# EAGLE schematic FreqDiv12080 (EAGLE 6.1)
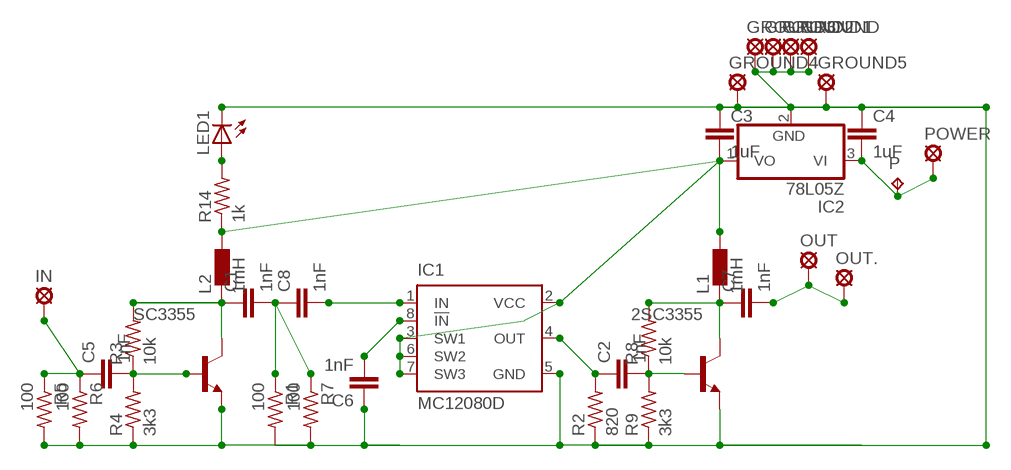
[diagram p0: schematic, sheet 1]

## Parts
2SC3355  BF199-NPN-TO92-BEC  [TO92-BEC]
C1  1nF  C5/3.5  [C5B3.5]
C2  1nF  C5/3.5  [C5B3.5]
C3  1uF  C5/3.5  [C5B3.5]
C4  1uF  C5/3.5  [C5B3.5]
C5  1nF  C5/3.5  [C5B3.5]
C6  1nF  C5/3.5  [C5B3.5]
C7  1nF  C5/3.5  [C5B3.5]
C8  1nF  C5/3.5  [C5B3.5]
GROUND  SE13  [SE13]
GROUND1  SE13  [SE13]
GROUND2  SE13  [SE13]
GROUND3  SE13  [SE13]
GROUND4  SE13  [SE13]
GROUND5  SE13  [SE13]
IC1  MC12080D  [SO08]
IC2  78L05Z  [TO92]
IN  SE13  [SE13]
L1  1mH  L0207/10  [0207/10]
L2  1mH  L0207/10  [0207/10]
LED1  LEDCHIPLED_1206  [CHIPLED_1206]
OUT  SE13  [SE13]
OUT.  SE13  [SE13]
P  TPPAD1-20  [P1-20]
POWER  SE13  [SE13]
R1  100  R-US_M1206  [M1206]
R2  820  R-US_M1206  [M1206]
R3  10k  R-US_M1206  [M1206]
R4  3k3  R-US_M1206  [M1206]
R5  100  R-US_M1206  [M1206]
R6  100  R-US_M1206  [M1206]
R7  100  R-US_M1206  [M1206]
R8  10k  R-US_M1206  [M1206]
R9  3k3  R-US_M1206  [M1206]
R14  1k  R-US_M1206  [M1206]
SC3355  BF199-NPN-TO92-BEC  [TO92-BEC]

## Nets
N$1: C4.2 IC2.3(VI) P.TP POWER.MP
N$2: C2.1 IC1.4(OUT) R2.2
N$3: 2SC3355.B C2.2 R8.1 R9.2
N$4: C3.2 IC1.2(VCC) IC1.3(SW1) IC1.6(SW2) IC1.7(SW3) IC2.1(VO) L1.1 L2.1 R14.1
N$5: C5.1 IN.MP R5.1 R6.1
N$6: C5.2 R3.1 R4.2 SC3355.B
N$7: C7.1 OUT..MP OUT.MP
N$8: 2SC3355.C C7.2 L1.2 R8.2
N$10: LED1.A R14.2
N$11: C6.2 IC1.8(!IN)
N$12: C1.2 C8.1 R1.1 R7.1
N$14: 2SC3355.E C3.1 C4.1 C6.1 GROUND1.MP GROUND2.MP GROUND3.MP GROUND4.MP GROUND5.MP GROUND.MP IC1.5(GND) IC2.2(GND) LED1.C R1.2 R2.1 R4.1 R5.2 R6.2 R7.2 R9.1 SC3355.E
N$16: C8.2 IC1.1(IN)
N$17: C1.1 L2.2 R3.2 SC3355.C

## Library data of the parts
2SC3355 SC3355 = transistor:*-NPN-: NPN Transistror BF959 corrected 2008.03.06
C1-C8 = capacitor-wima:C: CAPACITOR naming: grid - package width
GROUND GROUND1-GROUND5 IN OUT OUT. POWER = solpad:SE13: SOLDER PAD E1542, drill 1,3mm, distributor Buerklin, 07F815
IC1 = on-semiconductor:MC12080: 1.1 GHz Prescaler MECL PLL COMPONENTS ÷10/20/40/80 PRESCALER Source: http://motorola.com/sps .. MC12080.pdf; MF: ON SEMICONDUCTOR; MPN: MC12080D; OC_FARNELL: 1607924; OC_NEWARK: 40C2542
IC2 = linear:78*: Positive VOLTAGE REGULATOR Source: http://cache.national.com/ds/LM/LM78L05.pdf http://www.fairchildsemi.com/ds/LM/LM7805.pdf
L1 L2 = eagle-ltspice:L: INDUCTOR, European symbol; SPICEMODEL: NONE; SPICEPREFIX: L
LED1 = adafruit:LED: LED OSRAM: - CHIPLED LG R971, LG N971, LY N971, LG Q971, LY Q971, LO R971, LY R971 LH N974, LH R974 LS Q976, LO Q976, LY Q976 LO Q996 - Hyper CHIPLED LW Q18S LB Q993, LB Q99A, LB R99A - SideLED LS A670, LO A670, LY A670, LG A670, LP A670 LB A673, LV A673, LT A673, LW A673 LH A674 LY A675 LS A676, LA A676, LO A676, LY A676, LW A676 LS A679, LY A679, LG A679 - Hyper Micro SIDELED® LS Y876, LA Y876, LO Y876, LY Y876 LT Y87S - SmartLED LW L88C, LW L88S LB L89C, LB L89S, LG L890 LS L89K, LO L89K, LY L89K LS L896, LA L896, LO L896, LY L896 - TOPLED LS T670, LO T670, LY T670, LG T670, LP T670 LSG T670, LSP T670, LSY T670, LOP T670, LYG T670 LG T671, LOG T671, LSG T671 LB T673, LV T673, LT T673, LW T673 LH T674 LS T676, LA T676, LO T676, LY T676, LB T676, LH T676, LSB T676, LW T676 LB T67C, LV T67C, LT T67C, LS T67K, LO T67K, LY T67K, LW E67C LS E67B, LA E67B, LO E67B, LY E67B, LB E67C, LV E67C, LT E67C LW T67C LS T679, LY T679, LG T679 LS T770, LO T770, LY T770, LG T770, LP T770 LB T773, LV T773, LT T773, LW T773 LH T774 LS E675, LA E675, LY E675, LS T675 LS T776, LA T776, LO T776, LY T776, LB T776 LHGB T686 LT T68C, LB T68C - Hyper Mini TOPLED® LB M676 - Mini TOPLED Santana® LG M470 LS M47K, LO M47K, LY M47K Source: http://www.osram.convergy.de/
P = testpad:TP: Test pad
R1-R9 R14 = adafruit:R-US_: RESISTOR, American symbol